# Altium schematic sheet RaceDAQ_MCU.SchDoc
size A4; SheetNumber: 4; SheetTotal: 4
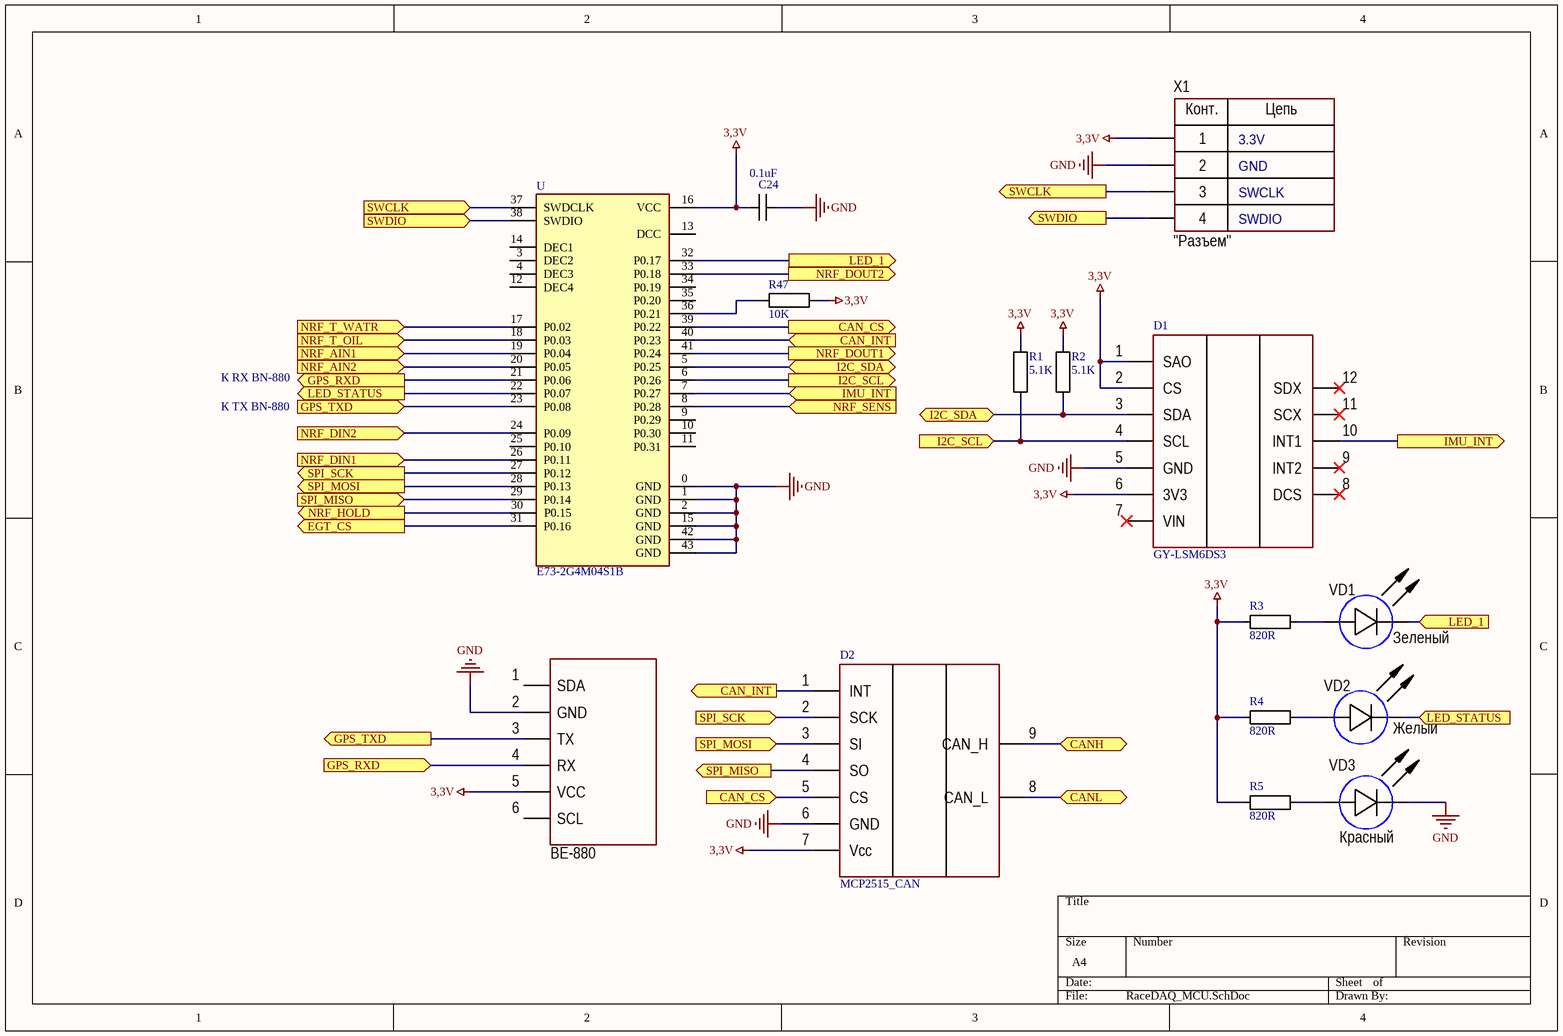
[diagram p0: RaceDAQ_MCU.SchDoc]

## Parts
BE-880  (no value)  [GPS:BE880]
C24  0.1uF  [CAPC1608X90L25N]
D1  GY-LSM6DS3  [AXL:LSM6DS3]
D2  MCP2515_CAN  [MDL:MCP2515]
R1  5.1K  [RESC2012X60L35N]
R2  5.1K  [RESC2012X60L35N]
R3  820R  [RESC2012X60L35N]
R4  820R  [RESC2012X60L35N]
R5  820R  [RESC2012X60L35N]
R47  10K  [RESC2012X60L35N]
U  E73-2G4M04S1B  [XCVR_E73-2G4M04S1B]
VD1  Color: Зеленый  [DIODE: LED3MM_Y]
VD2  Color: Желый  [DIODE: LED3MM_Y]
VD3  Color: Красный  [DIODE: LED3MM_Y]
X1  CommentText: "Разъем"  [CON: PLS-4]

## Ports
CAN_CS (in), CAN_CS (out), CAN_INT (in), CAN_INT (out), CANH (bidir), CANL (bidir), EGT_CS (out), GPS_RXD (in), GPS_RXD (out), GPS_TXD (in), GPS_TXD (out), I2C_SCL (in), I2C_SCL (out), I2C_SDA (bidir), IMU_INT (in), IMU_INT (out), LED_1 (in), LED_1 (out), LED_STATUS (in), LED_STATUS (out), NRF_AIN1 (in), NRF_AIN2 (in), NRF_DIN1 (in), NRF_DIN2 (in), NRF_DOUT1 (out), NRF_DOUT2 (out), NRF_HOLD (out), NRF_SENS (in), NRF_T_OIL (in), NRF_T_WATR (in), SPI_MISO (in), SPI_MISO (out), SPI_MOSI (in), SPI_MOSI (out), SPI_SCK (in), SPI_SCK (out), SWCLK (in), SWCLK (out), SWDIO (in), SWDIO (out)

## Nets
3,3V: BE-880.5(VCC) C24.2 D1.1(SAO) D1.2(CS) D1.6(3V3) D2.7(Vcc) R1.2 R2.2 R3.1 R4.1 R5.1 R47.1 X1.1
GND: BE-880.2(GND) C24.1 D1.5(GND) D2.6(GND) U.15(GND) U.42(GND) U.43(GND) VD3.2(C) X1.2
CAN_CS: D2.5(CS) U.39(P0.22) ; port CAN_CS
CAN_INT: D2.1(INT) U.40(P0.23) ; port CAN_INT
CANH: D2.9(CAN_H) ; port CANH
CANL: D2.8(CAN_L) ; port CANL
EGT_CS: U.31(P0.16) ; port EGT_CS
GPS_RXD: BE-880.4(RX) U.21(P0.06) ; port GPS_RXD
GPS_TXD: BE-880.3(TX) U.23(P0.08) ; port GPS_TXD
I2C_SCL: D1.4(SCL) R1.1 U.6(P0.26) ; port I2C_SCL
I2C_SDA: D1.3(SDA) R2.1 U.5(P0.25) ; port I2C_SDA
IMU_INT: D1.10(INT1) U.7(P0.27) ; port IMU_INT
LED_1: VD1.2(C) ; port LED_1
LED_STATUS: U.22(P0.07) VD2.2(C) ; port LED_STATUS
NRF_AIN1: U.19(P0.04) ; port NRF_AIN1
NRF_AIN2: U.20(P0.05) ; port NRF_AIN2
NRF_DIN1: U.26(P0.11) ; port NRF_DIN1
NRF_DIN2: U.24(P0.09) ; port NRF_DIN2
NRF_DOUT1: U.41(P0.24) ; port NRF_DOUT1
NRF_DOUT2: U.33(P0.18) ; port NRF_DOUT2
NRF_HOLD: U.30(P0.15) ; port NRF_HOLD
NRF_SENS: U.8(P0.28) ; port NRF_SENS
NRF_T_OIL: U.18(P0.03) ; port NRF_T_OIL
NRF_T_WATR: U.17(P0.02) ; port NRF_T_WATR
SPI_MISO: D2.4(SO) U.29(P0.14) ; port SPI_MISO
SPI_MOSI: D2.3(SI) U.28(P0.13) ; port SPI_MOSI
SPI_SCK: D2.2(SCK) U.27(P0.12) ; port SPI_SCK
SWCLK: U.37(SWDCLK) X1.3 ; port SWCLK
SWDIO: U.38(SWDIO) X1.4 ; port SWDIO
NetR3_2: R3.2 VD1.1(A)
NetR4_2: R4.2 VD2.1(A)
NetR5_2: R5.2 VD3.1(A)
NetR47_2: R47.2 U.36(P0.21)

Not connected (* = marked no-connect by the designer): BE-880 1(SDA) 6(SCL); D1 7(VIN)* 8(DCS)* 9(INT2)* 11(SCX)* 12(SDX)*; U 0(GND) 1(GND) 2(GND) 3(DEC2) 4(DEC3) 9(P0.29) 10(P0.30) 11(P0.31) 12(DEC4) 13(DCC) 14(DEC1) 16(VCC) 25(P0.10) 32(P0.17) 34(P0.19) 35(P0.20)

## Notes on the sheet
- 3.3V
- GND
- SWCLK
- SWDIO
- К RX BN-880
- К TX BN-880
- (in symbol PLS-4) Конт.; Цепь

## Library data of the parts
BE-880 = BE-880: Gate driver; VoltageSupply: supply -12...+20V; Frequency: 1MHz; CurrentOutput: ±2A; VoltageWork: 1200V; CMTI: 100kV/μs; Temperature: -40...+150°C
C24 = C0603: PartNumber: CL10B104KB8NNNC; Type: C0603; Voltage: 50V; Value: 0.1uF
D2 = MCP2515_Mod
R1-R5 R47 = R0805: Type: R0805
  R1 R2: Value: 5.1K
  R3-R5: Value: 820R
  R47: Value: 10K
U = E73-2G4M04S1B: nRF52832 BLE 4.2/5.0 SMD Wireless Module; MF: EBYTE; Availability: Unavailable; Price: None; Package: Package; MP: E73-2G4M04S1B; Value: *; SnapEDA_Link: https://www.snapeda.com/parts/E73-2G4M04S1B/EBYTE/view-part/4219264/?ref=snap
VD1-VD3 = LED_single_3mm: ValueManufacturerPartNumber: LED, Green, *, *, *, -55...+150°C; TypeDiode: LED; ColorParameter: Green; Manufacturer: *; Package: *; HelpURL: *; Temperature: -55...+150°C; Current: *; VoltageDrop: *; PartNumber: *
X1 = PLS-4: Manufacturer: Connfly; ValueManufacturerPartNumber: Connector, 4pin, 2.54mm, 500VAC, 3A; TypeConnector: Connector; VoltageMax: 500VAC; Pitch: 2.54mm; CurrentMax: 3A; Multichannel: 4pin; HelpURL: https://www.chipdip.ru/product/pls-4; PartNumber: PLS-4